# Altium schematic sheet ICAN-7006-US.SchDoc
size A3; PageSetup: Record=PageOptions|CenterHorizontal=True|CenterVertical=True|PrintScale=1.04|XCorrection=1.00|YCorrection=1.00|PrintKind=0|BorderSize=5000000|LeftOffset=0|BottomOffset=0|Orientation=2|PaperLength=1000|PaperWidth=1000|Scale=100|PaperSource=7|PrintQuality=-4|MediaType=1|DitherType=10|PaperKind=A3|PrintScaleMode=1
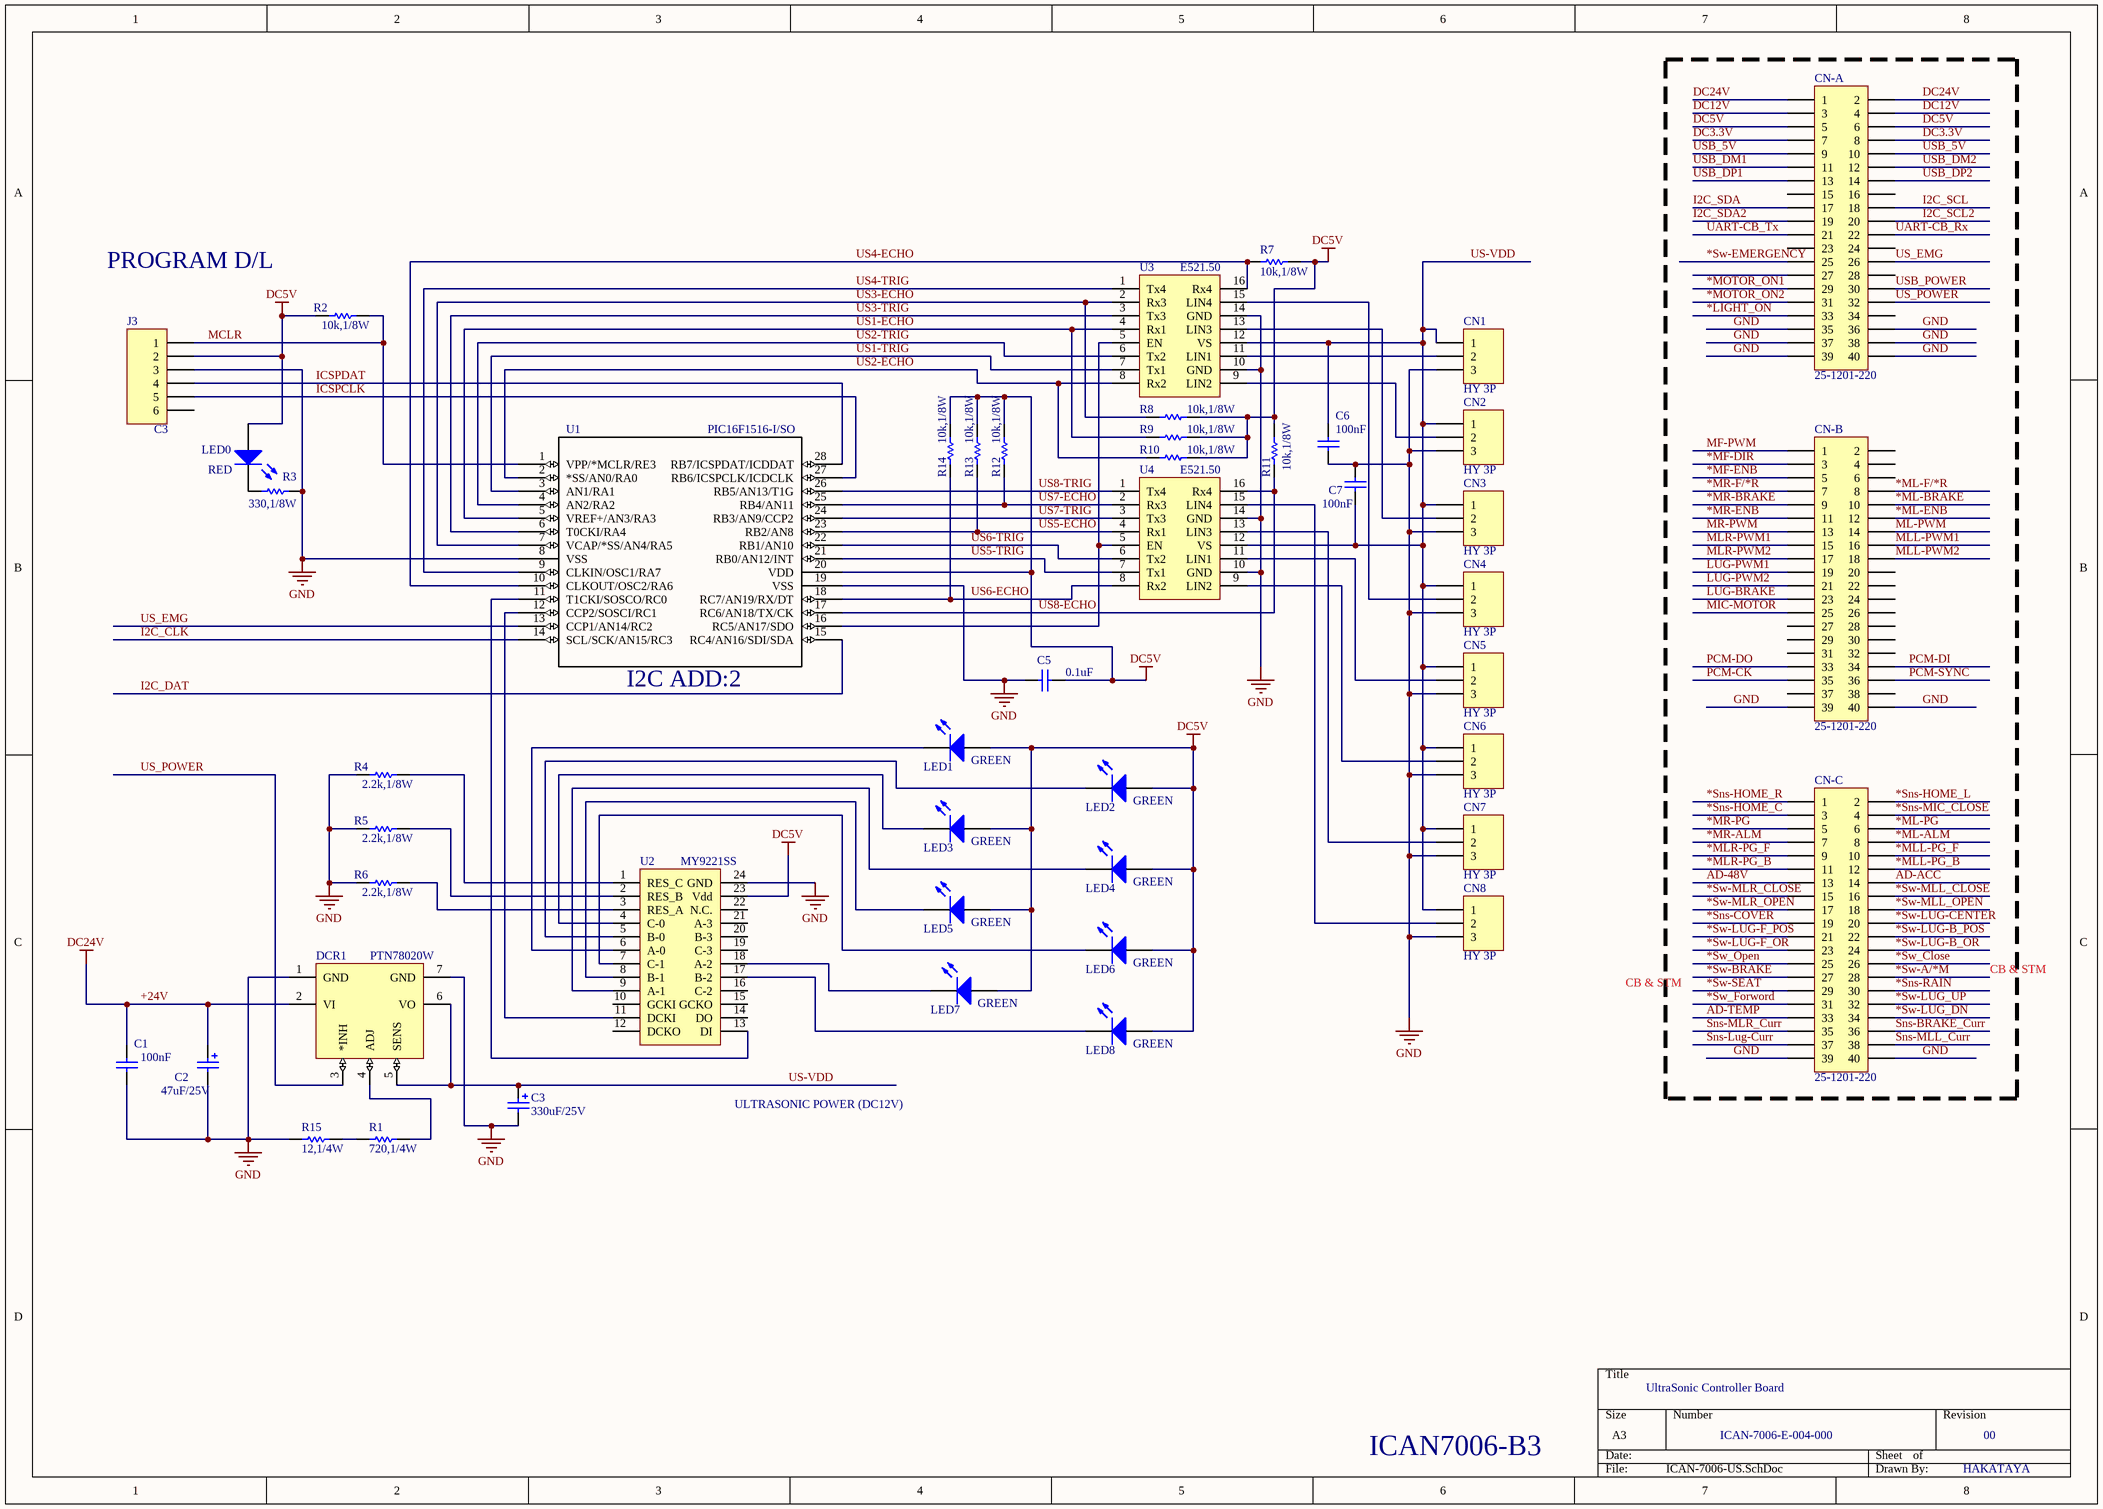
[diagram p0: ICAN-7006-US.SchDoc]

## Parts
C1  100nF  [[0805]2012]
C2  47uF/25V  [Capa MH5 PITCH2.5mm]
C3  330uF/25V  [CAPA WXA PITCH 5.0mm]
C5  0.1uF  [[0805]2012]
C6  100nF  [[0805]2012]
C7  100nF  [[0805]2012]
CN1  HY 3P  [HY-3AW]
CN2  HY 3P  [HY-3AW]
CN3  HY 3P  [HY-3AW]
CN4  HY 3P  [HY-3AW]
CN5  HY 3P  [HY-3AW]
CN6  HY 3P  [HY-3AW]
CN7  HY 3P  [HY-3AW]
CN8  HY 3P  [HY-3AW]
CN-A  25-1201-220  [HDR2X20]
CN-B  25-1201-220  [HDR2X20]
CN-C  25-1201-220  [HDR2X20]
DCR1  PTN78020W  [PTN78020]
J3  C3  [C3-S6]
LED0  RED  [3.5X2.8X1.9]
LED1  GREEN  [3.5X2.8X1.9]
LED2  GREEN  [3.5X2.8X1.9]
LED3  GREEN  [3.5X2.8X1.9]
LED4  GREEN  [3.5X2.8X1.9]
LED5  GREEN  [3.5X2.8X1.9]
LED6  GREEN  [3.5X2.8X1.9]
LED7  GREEN  [3.5X2.8X1.9]
LED8  GREEN  [3.5X2.8X1.9]
R1  720,1/4W  [[1206]3216]
R2  10k,1/8W  [[0805]2012]
R3  330,1/8W  [[0805]2012]
R4  2.2k,1/8W  [[0805]2012]
R5  2.2k,1/8W  [[0805]2012]
R6  2.2k,1/8W  [[0805]2012]
R7  10k,1/8W  [[0805]2012]
R8  10k,1/8W  [[0805]2012]
R9  10k,1/8W  [[0805]2012]
R10  10k,1/8W  [[0805]2012]
R11  10k,1/8W  [[0805]2012]
R12  10k,1/8W  [[0805]2012]
R13  10k,1/8W  [[0805]2012]
R14  10k,1/8W  [[0805]2012]
R15  12,1/4W  [[1206]3216]
U1  PIC16F1516-I/SO  [SOIC28-W_MC]
U2  MY9221SS  [SSOP 24]
U3  E521.50  [RU-16]
U4  E521.50  [RU-16]

## Blocks framed on the sheet
CB & STM: CN-A CN-B CN-C

## Nets
+24V: C1.2 C2.1 CN-A.1 CN-A.2 DCR1.2(VI)  [also labelled DC24V]
DC5V: C5.2 CN-A.5 CN-A.6 J3.2 LED0.1(A) LED1.1(A) LED2.1(A) LED3.1(A) LED4.1(A) LED5.1(A) LED6.1(A) LED7.1(A) LED8.1(A) R2.1 R7.2 R8.2 R9.2 R10.2 R11.2 R12.2 R13.2 R14.2 U1.20(VDD) U2.23(Vdd)
GND: C1.1 C2.2 C3.2 C5.1 C6.1 C7.2 CN1.3 CN2.3 CN3.3 CN4.3 CN5.3 CN6.3 CN7.3 CN8.3 CN-A.35 CN-A.36 CN-A.37 CN-A.38 CN-A.39 CN-A.40 CN-B.39 CN-B.40 CN-C.39 CN-C.40 DCR1.1(GND) DCR1.7(GND) J3.3 R3.2 R4.1 R5.1 R6.1 R15.1 U1.8(VSS) U1.19(VSS) U2.24(GND) U3.10(GND) U3.14(GND) U4.10(GND) U4.14(GND)
*LIGHT_ON: CN-A.33
*MF-DIR: CN-B.3
*MF-ENB: CN-B.5
*ML-ALM: CN-C.8
*ML-BRAKE: CN-B.10
*ML-ENB: CN-B.12
*ML-F/*R: CN-B.8
*ML-PG: CN-C.6
*MLL-PG_B: CN-C.12
*MLL-PG_F: CN-C.10
*MLR-PG_B: CN-C.11
*MLR-PG_F: CN-C.9
*MOTOR_ON1: CN-A.29
*MOTOR_ON2: CN-A.31
*MR-ALM: CN-C.7
*MR-BRAKE: CN-B.9
*MR-ENB: CN-B.11
*MR-F/*R: CN-B.7
*MR-PG: CN-C.5
*Sns-COVER: CN-C.19
*Sns-HOME_C: CN-C.3
*Sns-HOME_L: CN-C.2
*Sns-HOME_R: CN-C.1
*Sns-MIC_CLOSE: CN-C.4
*Sns-RAIN: CN-C.30
*Sw-A/*M: CN-C.28
*Sw-BRAKE: CN-C.27
*Sw-EMERGENCY: CN-A.25
*Sw-LUG-B_OR: CN-C.24
*Sw-LUG-B_POS: CN-C.22
*Sw-LUG-CENTER: CN-C.20
*Sw-LUG-F_OR: CN-C.23
*Sw-LUG-F_POS: CN-C.21
*Sw-LUG_DN: CN-C.34
*Sw-LUG_UP: CN-C.32
*Sw-MLL_CLOSE: CN-C.16
*Sw-MLL_OPEN: CN-C.18
*Sw-MLR_CLOSE: CN-C.15
*Sw-MLR_OPEN: CN-C.17
*Sw-SEAT: CN-C.29
*Sw_Close: CN-C.26
*Sw_Forword: CN-C.31
*Sw_Open: CN-C.25
AD-48V: CN-C.13
AD-ACC: CN-C.14
AD-TEMP: CN-C.33
DC3.3V: CN-A.7 CN-A.8
DC12V: CN-A.3 CN-A.4
I2C_CLK: U1.14(SCL/SCK/AN15/RC3)
I2C_DAT: U1.15(RC4/AN16/SDI/SDA)
I2C_SCL: CN-A.18
I2C_SCL2: CN-A.20
I2C_SDA: CN-A.17
I2C_SDA2: CN-A.19
ICSPCLK: J3.5 U1.27(RB6/ICSPCLK/ICDCLK)
ICSPDAT: J3.4 U1.28(RB7/ICSPDAT/ICDDAT)
LUG-BRAKE: CN-B.23
LUG-PWM1: CN-B.19
LUG-PWM2: CN-B.21
MCLR: J3.1 R2.2 U1.1(VPP/*MCLR/RE3)
MF-PWM: CN-B.1
MIC-MOTOR: CN-B.25
ML-PWM: CN-B.14
MLL-PWM1: CN-B.16
MLL-PWM2: CN-B.18
MLR-PWM1: CN-B.15
MLR-PWM2: CN-B.17
MR-PWM: CN-B.13
PCM-CK: CN-B.35
PCM-DI: CN-B.34
PCM-DO: CN-B.33
PCM-SYNC: CN-B.36
Sns-BRAKE_Curr: CN-C.36
Sns-Lug-Curr: CN-C.37
Sns-MLL_Curr: CN-C.38
Sns-MLR_Curr: CN-C.35
UART-CB_Rx: CN-A.22
UART-CB_Tx: CN-A.21
US1-ECHO: R9.1 U1.5(VREF+/AN3/RA3) U3.4(Rx1)
US1-TRIG: U1.3(AN1/RA1) U3.7(Tx1)
US2-ECHO: R10.1 U1.2(*SS/AN0/RA0) U3.8(Rx2)
US2-TRIG: U1.4(AN2/RA2) U3.6(Tx2)
US3-ECHO: R8.1 U1.7(VCAP/*SS/AN4/RA5) U3.2(Rx3)
US3-TRIG: U1.6(T0CKI/RA4) U3.3(Tx3)
US4-ECHO: R7.1 U1.10(CLKOUT/OSC2/RA6) U3.16(Rx4)
US4-TRIG: U1.9(CLKIN/OSC1/RA7) U3.1(Tx4)
US5-ECHO: R13.1 U1.23(RB2/AN8) U4.4(Rx1)
US5-TRIG: U1.21(RB0/AN12/INT) U4.7(Tx1)
US6-ECHO: R14.1 U1.18(RC7/AN19/RX/DT) U4.8(Rx2)
US6-TRIG: U1.22(RB1/AN10) U4.6(Tx2)
US7-ECHO: R12.1 U1.25(RB4/AN11) U4.2(Rx3)
US7-TRIG: U1.24(RB3/AN9/CCP2) U4.3(Tx3)
US8-ECHO: R11.1 U1.17(RC6/AN18/TX/CK) U4.16(Rx4)
US8-TRIG: U1.26(RB5/AN13/T1G) U4.1(Tx4)
US-VDD: C3.1 C6.2 C7.1 CN1.1 CN2.1 CN3.1 CN4.1 CN5.1 CN6.1 CN7.1 CN8.1 DCR1.5(SENS) DCR1.6(VO) U3.12(VS) U4.12(VS)
US_EMG: CN-A.26 U1.13(CCP1/AN14/RC2)
US_POWER: CN-A.32 DCR1.3(*INH)
USB_5V: CN-A.9 CN-A.10
USB_DM1: CN-A.11
USB_DM2: CN-A.12
USB_DP1: CN-A.13
USB_DP2: CN-A.14
USB_POWER: CN-A.30
NetCN1_2: CN1.2 U3.11(LIN1)
NetCN2_2: CN2.2 U3.9(LIN2)
NetCN3_2: CN3.2 U3.13(LIN3)
NetCN4_2: CN4.2 U3.15(LIN4)
NetCN5_2: CN5.2 U4.11(LIN1)
NetCN6_2: CN6.2 U4.9(LIN2)
NetCN7_2: CN7.2 U4.13(LIN3)
NetCN8_2: CN8.2 U4.15(LIN4)
NetDCR1_4: DCR1.4(ADJ) R1.2
NetLED0_2: LED0.2(K) R3.1
NetLED1_2: LED1.2(K) U2.6(A-0)
NetLED2_2: LED2.2(K) U2.5(B-0)
NetLED3_2: LED3.2(K) U2.4(C-0)
NetLED4_2: LED4.2(K) U2.9(A-1)
NetLED5_2: LED5.2(K) U2.8(B-1)
NetLED6_2: LED6.2(K) U2.7(C-1)
NetLED7_2: LED7.2(K) U2.18(A-2)
NetLED8_2: LED8.2(K) U2.17(B-2)
NetR1_1: R1.1 R15.2
NetR4_2: R4.2 U2.1(RES_C)
NetR5_2: R5.2 U2.2(RES_B)
NetR6_2: R6.2 U2.3(RES_A)
NetU1_11: U1.11(T1CKI/SOSCO/RC0) U2.13(DI)
NetU1_12: U1.12(CCP2/SOSCI/RC1) U2.11(DCKI)
NetU1_16: U1.16(RC5/AN17/SDO) U3.5(EN) U4.5(EN)

Not connected (* = marked no-connect by the designer): CN-A 15 16 23 24 27 28 34; CN-B 2 4 6 20 22 24 26 27 28 29 30 31 32 37 38; J3 6; U2 10(GCKI) 12(DCKO) 14(DO) 15(GCKO) 16(C-2) 19(C-3) 20(B-3) 21(A-3) 22(N.C.)

## Notes on the sheet
- PROGRAM D/L
- (near U1) I2C ADD:2
- CB & STM
- ULTRASONIC POWER (DC12V)
- UltraSonic Controller Board
- ICAN7006-B3
- ICAN-7006-E-004-000
- 00
- HAKATAYA

## Library data of the parts
C1 C6 C7 = Cap: Capacitor; Value: 100pF; Published: 8-Jun-2000; LatestRevisionDate: 17-Jul-2002; LatestRevisionNote: Re-released for DXP Platform.; PackageReference: RAD-0.3; Publisher: Altium Limited
C2 C3 = Cap Pol2: Polarized Capacitor (Axial); Published: 8-Jun-2000; LatestRevisionDate: 17-Jul-2002; LatestRevisionNote: Re-released for DXP Platform.; PackageReference: POLAR0.8; Publisher: Altium Limited
  C2: Value: 47uF/25V; Supplier Part Number: MH5 47uF/25V
  C3: Value: 330uF/25V; Supplier Part Number: WXA 330uF/25V
C5 = Cap: Capacitor; Published: 8-Jun-2000; LatestRevisionDate: 17-Jul-2002; LatestRevisionNote: Re-released for DXP Platform.; PackageReference: RAD-0.3; Publisher: Altium Limited; Value: 0.1uF
CN1-CN8 = Header 3: Header, 3-Pin; LatestRevisionDate: 17-Jul-2002; LatestRevisionNote: Re-released for DXP Platform.; Publisher: Altium Limited; Supplier: YOLINK; Supplier Part Number: A2006-03AW
CN-A CN-B CN-C = Header 20X2: Header, 20-Pin, Dual row; LatestRevisionDate: 17-Jul-2002; LatestRevisionNote: Re-released for DXP Platform.; Publisher: Altium Limited; Supplier: Astron Corporation.; URL: http://www.astron.com.tw/product.php?idt=1&pid=68&pno=212; Supplier Part Number: 25-1201-220
DCR1 = PTN78020: REGURATOR; Supplier Part Number: PTN78020W
J3 = Header 6: Header, 6-Pin; LatestRevisionDate: 17-Jul-2002; LatestRevisionNote: Re-released for DXP Platform.; Publisher: Altium Limited
LED0-LED8 = LED3: Typical BLUE SiC LED; Value: 3.5X2.8X1.9 LED; Published: 8-Jun-2000; LatestRevisionDate: 17-Dec-2003; LatestRevisionNote: PCB Footprint replaced.; DatasheetDocument: 16-Apr-2002; PackageDocument: 16-Apr-2002; PackageReference: 3.5X2.8X1.9; Publisher: Altium Limited
R1-R15 = Res1: Resistor; Published: 8-Jun-2000; LatestRevisionDate: 17-Jul-2002; LatestRevisionNote: Re-released for DXP Platform.; PackageReference: AXIAL-0.3; Publisher: Altium Limited
  R1: Value: 720,1/4W
  R2 R7-R14: Value: 10k,1/8W
  R3: Value: 330,1/8W
  R4-R6: Value: 2.2k,1/8W
  R15: Value: 12,1/4W
U1 = PIC16F1516-x_SO: PIC; RefDes: RefDes; Type: DEV; Value: PIC16F1516-I/SO; Supplier Part Number: PIC16F1516-I/SO
U2 = IC24: LED Driver; Supplier Part Number: MY9221SS; Supplier: MY-semi
U3 U4 = IC16: Driver; Supplier Part Number: E521.50